# EasyEDA Pro project LED_Multichanel_bulb.eprj

# Schematic Schematic1
Board Name: Board1; Create Date: 2025-07-30; Page Name: P1; Project Name: LED_Multichanel_bulb; Schematic Name: Schematic1; Update Date: 2025-07-30; Company: embedberight.com; Page Size: A4; Version: V1.0
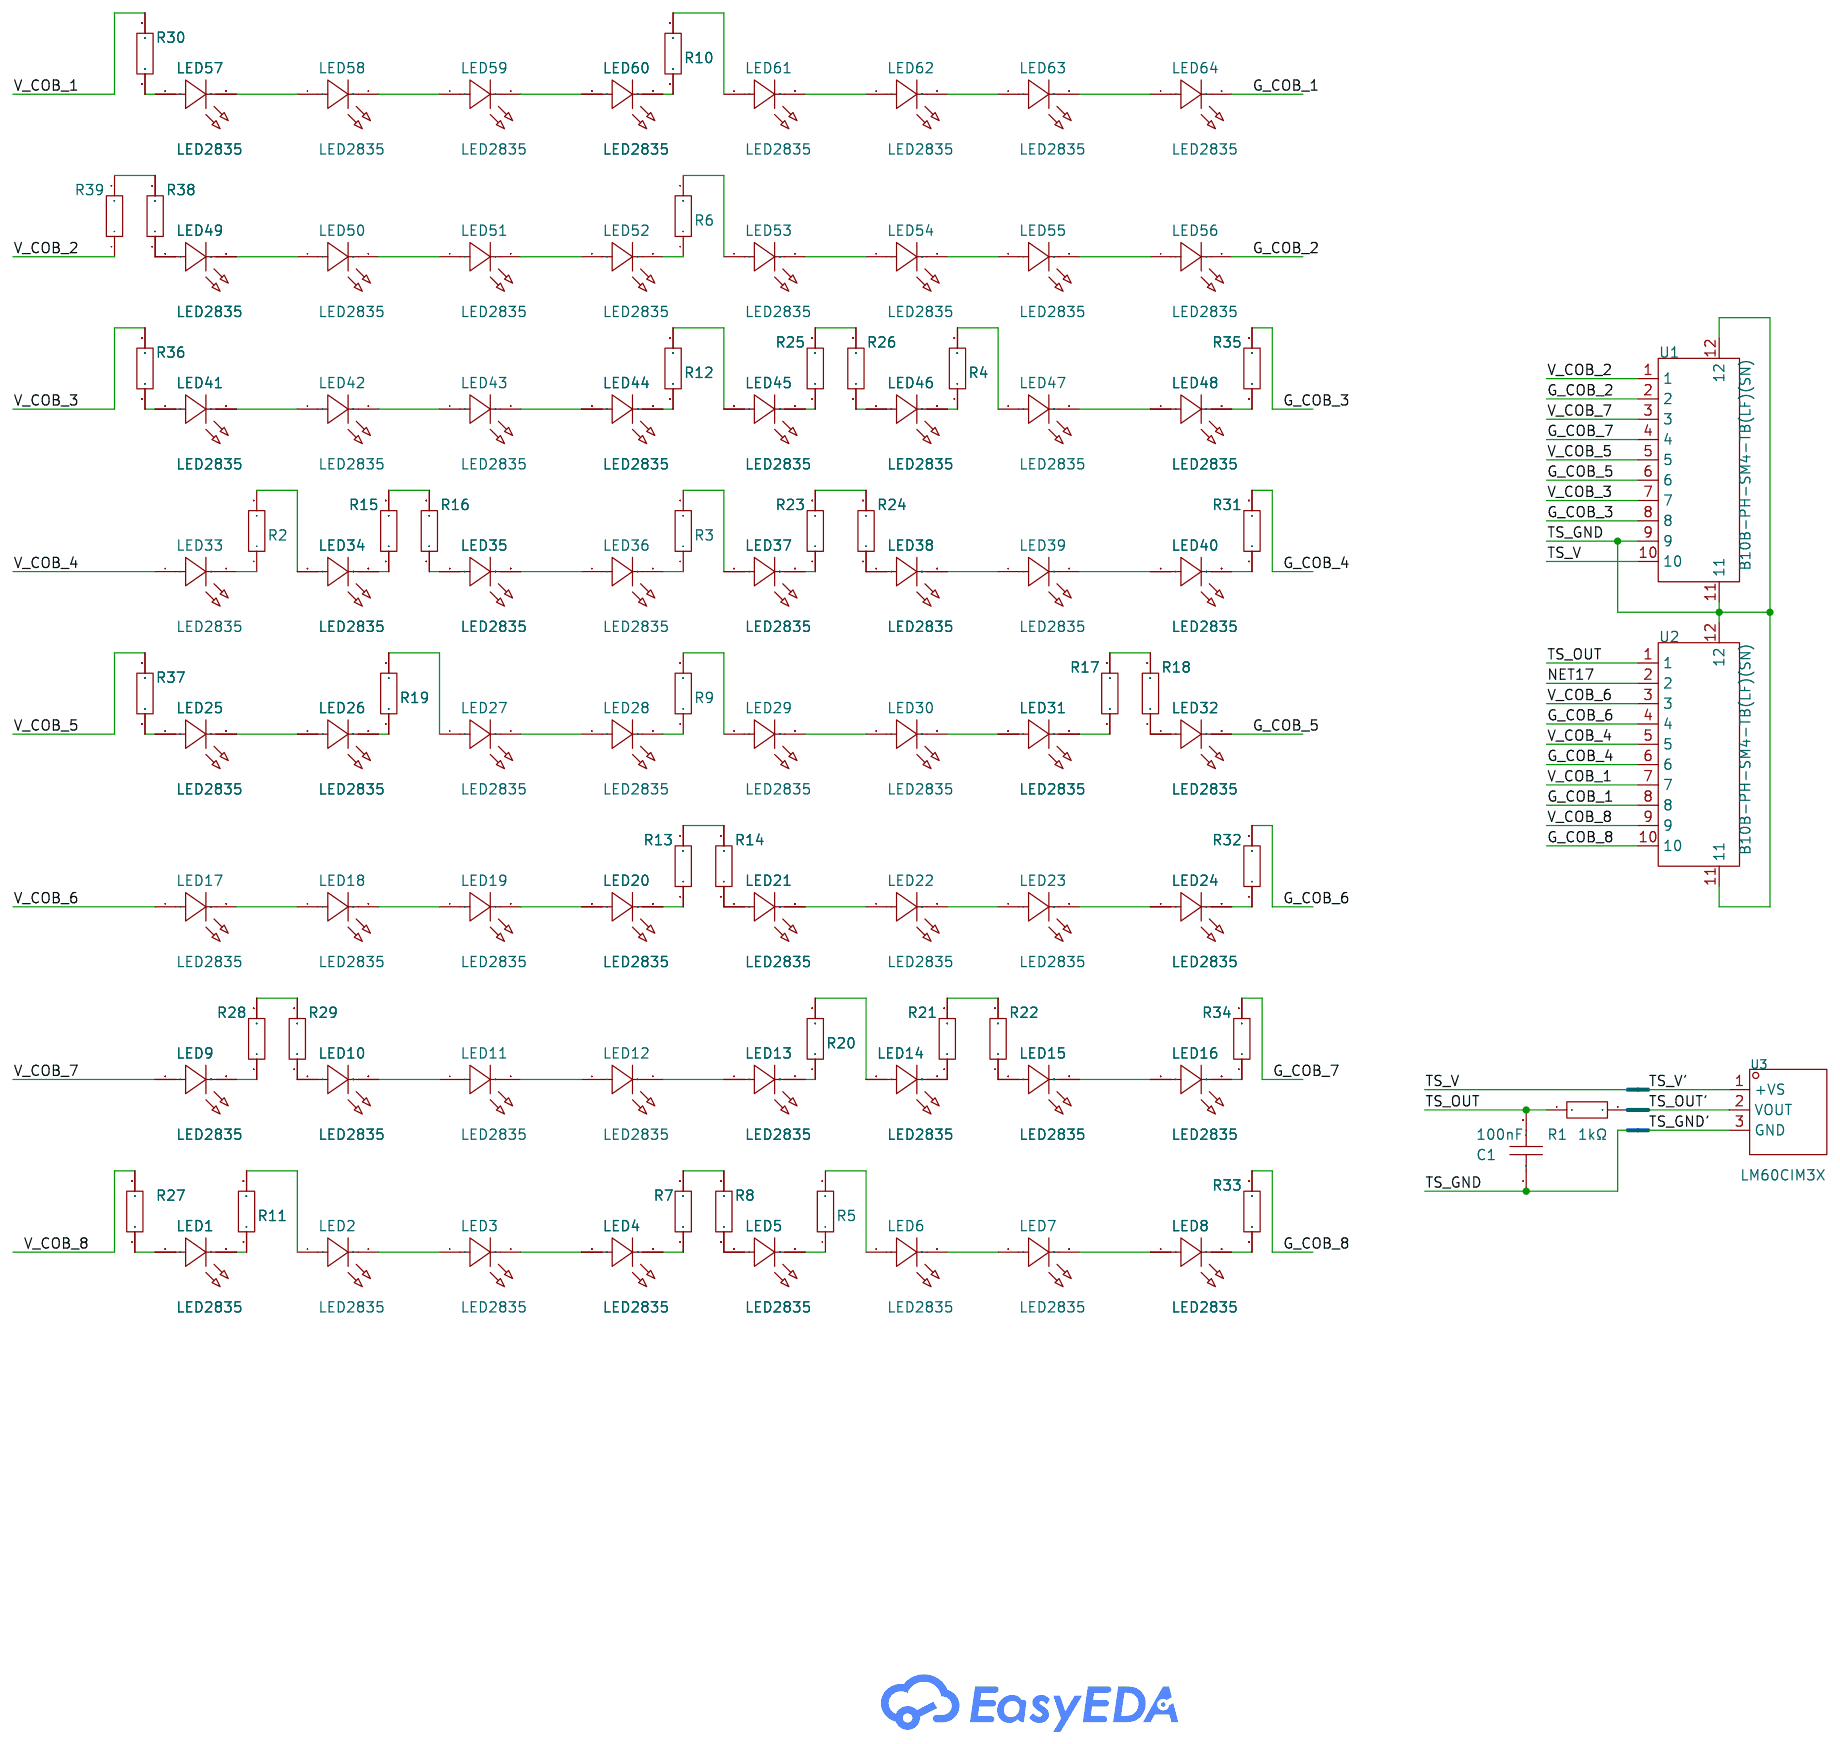
[diagram p0: schematic sheet]

## Parts
C1  100nF  [C0805]
LED1  LED2835  [LED-SMD_L3.5-W2.8_JE2835APO-N-0001A0000-N0000001]
LED2  LED2835  [LED-SMD_L3.5-W2.8_JE2835APO-N-0001A0000-N0000001]
LED3  LED2835  [LED-SMD_L3.5-W2.8_JE2835APO-N-0001A0000-N0000001]
LED4  LED2835  [LED-SMD_L3.5-W2.8_JE2835APO-N-0001A0000-N0000001]
LED5  LED2835  [LED-SMD_L3.5-W2.8_JE2835APO-N-0001A0000-N0000001]
LED6  LED2835  [LED-SMD_L3.5-W2.8_JE2835APO-N-0001A0000-N0000001]
LED7  LED2835  [LED-SMD_L3.5-W2.8_JE2835APO-N-0001A0000-N0000001]
LED8  LED2835  [LED-SMD_L3.5-W2.8_JE2835APO-N-0001A0000-N0000001]
LED9  LED2835  [LED-SMD_L3.5-W2.8_JE2835APO-N-0001A0000-N0000001]
LED10  LED2835  [LED-SMD_L3.5-W2.8_JE2835APO-N-0001A0000-N0000001]
LED11  LED2835  [LED-SMD_L3.5-W2.8_JE2835APO-N-0001A0000-N0000001]
LED12  LED2835  [LED-SMD_L3.5-W2.8_JE2835APO-N-0001A0000-N0000001]
LED13  LED2835  [LED-SMD_L3.5-W2.8_JE2835APO-N-0001A0000-N0000001]
LED14  LED2835  [LED-SMD_L3.5-W2.8_JE2835APO-N-0001A0000-N0000001]
LED15  LED2835  [LED-SMD_L3.5-W2.8_JE2835APO-N-0001A0000-N0000001]
LED16  LED2835  [LED-SMD_L3.5-W2.8_JE2835APO-N-0001A0000-N0000001]
LED17  LED2835  [LED-SMD_L3.5-W2.8_JE2835APO-N-0001A0000-N0000001]
LED18  LED2835  [LED-SMD_L3.5-W2.8_JE2835APO-N-0001A0000-N0000001]
LED19  LED2835  [LED-SMD_L3.5-W2.8_JE2835APO-N-0001A0000-N0000001]
LED20  LED2835  [LED-SMD_L3.5-W2.8_JE2835APO-N-0001A0000-N0000001]
LED21  LED2835  [LED-SMD_L3.5-W2.8_JE2835APO-N-0001A0000-N0000001]
LED22  LED2835  [LED-SMD_L3.5-W2.8_JE2835APO-N-0001A0000-N0000001]
LED23  LED2835  [LED-SMD_L3.5-W2.8_JE2835APO-N-0001A0000-N0000001]
LED24  LED2835  [LED-SMD_L3.5-W2.8_JE2835APO-N-0001A0000-N0000001]
LED25  LED2835  [LED-SMD_L3.5-W2.8_JE2835APO-N-0001A0000-N0000001]
LED26  LED2835  [LED-SMD_L3.5-W2.8_JE2835APO-N-0001A0000-N0000001]
LED27  LED2835  [LED-SMD_L3.5-W2.8_JE2835APO-N-0001A0000-N0000001]
LED28  LED2835  [LED-SMD_L3.5-W2.8_JE2835APO-N-0001A0000-N0000001]
LED29  LED2835  [LED-SMD_L3.5-W2.8_JE2835APO-N-0001A0000-N0000001]
LED30  LED2835  [LED-SMD_L3.5-W2.8_JE2835APO-N-0001A0000-N0000001]
LED31  LED2835  [LED-SMD_L3.5-W2.8_JE2835APO-N-0001A0000-N0000001]
LED32  LED2835  [LED-SMD_L3.5-W2.8_JE2835APO-N-0001A0000-N0000001]
LED33  LED2835  [LED-SMD_L3.5-W2.8_JE2835APO-N-0001A0000-N0000001]
LED34  LED2835  [LED-SMD_L3.5-W2.8_JE2835APO-N-0001A0000-N0000001]
LED35  LED2835  [LED-SMD_L3.5-W2.8_JE2835APO-N-0001A0000-N0000001]
LED36  LED2835  [LED-SMD_L3.5-W2.8_JE2835APO-N-0001A0000-N0000001]
LED37  LED2835  [LED-SMD_L3.5-W2.8_JE2835APO-N-0001A0000-N0000001]
LED38  LED2835  [LED-SMD_L3.5-W2.8_JE2835APO-N-0001A0000-N0000001]
LED39  LED2835  [LED-SMD_L3.5-W2.8_JE2835APO-N-0001A0000-N0000001]
LED40  LED2835  [LED-SMD_L3.5-W2.8_JE2835APO-N-0001A0000-N0000001]
LED41  LED2835  [LED-SMD_L3.5-W2.8_JE2835APO-N-0001A0000-N0000001]
LED42  LED2835  [LED-SMD_L3.5-W2.8_JE2835APO-N-0001A0000-N0000001]
LED43  LED2835  [LED-SMD_L3.5-W2.8_JE2835APO-N-0001A0000-N0000001]
LED44  LED2835  [LED-SMD_L3.5-W2.8_JE2835APO-N-0001A0000-N0000001]
LED45  LED2835  [LED-SMD_L3.5-W2.8_JE2835APO-N-0001A0000-N0000001]
LED46  LED2835  [LED-SMD_L3.5-W2.8_JE2835APO-N-0001A0000-N0000001]
LED47  LED2835  [LED-SMD_L3.5-W2.8_JE2835APO-N-0001A0000-N0000001]
LED48  LED2835  [LED-SMD_L3.5-W2.8_JE2835APO-N-0001A0000-N0000001]
LED49  LED2835  [LED-SMD_L3.5-W2.8_JE2835APO-N-0001A0000-N0000001]
LED50  LED2835  [LED-SMD_L3.5-W2.8_JE2835APO-N-0001A0000-N0000001]
LED51  LED2835  [LED-SMD_L3.5-W2.8_JE2835APO-N-0001A0000-N0000001]
LED52  LED2835  [LED-SMD_L3.5-W2.8_JE2835APO-N-0001A0000-N0000001]
LED53  LED2835  [LED-SMD_L3.5-W2.8_JE2835APO-N-0001A0000-N0000001]
LED54  LED2835  [LED-SMD_L3.5-W2.8_JE2835APO-N-0001A0000-N0000001]
LED55  LED2835  [LED-SMD_L3.5-W2.8_JE2835APO-N-0001A0000-N0000001]
LED56  LED2835  [LED-SMD_L3.5-W2.8_JE2835APO-N-0001A0000-N0000001]
LED57  LED2835  [LED-SMD_L3.5-W2.8_JE2835APO-N-0001A0000-N0000001]
LED58  LED2835  [LED-SMD_L3.5-W2.8_JE2835APO-N-0001A0000-N0000001]
LED59  LED2835  [LED-SMD_L3.5-W2.8_JE2835APO-N-0001A0000-N0000001]
LED60  LED2835  [LED-SMD_L3.5-W2.8_JE2835APO-N-0001A0000-N0000001]
LED61  LED2835  [LED-SMD_L3.5-W2.8_JE2835APO-N-0001A0000-N0000001]
LED62  LED2835  [LED-SMD_L3.5-W2.8_JE2835APO-N-0001A0000-N0000001]
LED63  LED2835  [LED-SMD_L3.5-W2.8_JE2835APO-N-0001A0000-N0000001]
LED64  LED2835  [LED-SMD_L3.5-W2.8_JE2835APO-N-0001A0000-N0000001]
R1  1kΩ  [R0805]
R2  10kΩ  [R1206]
R3  10kΩ  [R1206]
R4  10kΩ  [R1206]
R5  10kΩ  [R1206]
R6  10kΩ  [R1206]
R7  10kΩ  [R1206]
R8  10kΩ  [R1206]
R9  10kΩ  [R1206]
R10  10kΩ  [R1206]
R11  10kΩ  [R1206]
R12  10kΩ  [R1206]
R13  10kΩ  [R1206]
R14  10kΩ  [R1206]
R15  10kΩ  [R1206]
R16  10kΩ  [R1206]
R17  10kΩ  [R1206]
R18  10kΩ  [R1206]
R19  10kΩ  [R1206]
R20  10kΩ  [R1206]
R21  10kΩ  [R1206]
R22  10kΩ  [R1206]
R23  10kΩ  [R1206]
R24  10kΩ  [R1206]
R25  10kΩ  [R1206]
R26  10kΩ  [R1206]
R27  10kΩ  [R1206]
R28  10kΩ  [R1206]
R29  10kΩ  [R1206]
R30  10kΩ  [R1206]
R31  10kΩ  [R1206]
R32  10kΩ  [R1206]
R33  10kΩ  [R1206]
R34  10kΩ  [R1206]
R35  10kΩ  [R1206]
R36  10kΩ  [R1206]
R37  10kΩ  [R1206]
R38  10kΩ  [R1206]
R39  10kΩ  [R1206]
U1  B10B-PH-SM4-TB(LF)(SN)  [CONN-SMD_B10B-PH-SM4-TB-LF-SN]
U2  B10B-PH-SM4-TB(LF)(SN)  [CONN-SMD_B10B-PH-SM4-TB-LF-SN]
U3  LM60CIM3X  [SOT-23-3_L2.9-W1.3-P1.90-LS2.4-BR]

## Library data of the parts
C1 = CAP_0805: Supplier Footprint: 0805
LED1-LED64 = JE2835APO-N-0001A0000-N0000001: Supplier Part: C17632178; Manufacturer: WOLFSPEED; Supplier Footprint: SMD2835; JLCPCB Part Class: Extended Part; Datasheet: https://atta.szlcsc.com/upload/public/pdf/source/20231113/C6641F8E4F7B2C21D7D11EA73F223DEE.pdf; Supplier: LCSC
R1 = ERA6AEB102V: Type:Thin Film Resistor Resistance:1kΩ Tolerance:±0.1% Tolerance:±0.1% Power(Watts): Overload Voltage (Max): Temperature Coefficient:±25ppm/℃ Temperature Coefficient:±25ppm/℃ Operating Temperature Range:-55℃~+155℃ Operating Temperature Range:-55℃~+155℃; LCSC Part Name: 薄膜电阻 1kΩ ±0.1% 125mW; Supplier Part: C192073; Manufacturer: PANASONIC(松下); Supplier Footprint: 0805; JLCPCB Part Class: Extended Part; Datasheet: https://atta.szlcsc.com/upload/public/pdf/source/20180524/C193243_69C9336F256DFDBAD8C5AF89B6F85EFB.pdf; Supplier: LCSC; Type: Thin Film Resistor; Tolerance: ±0.1%; Temperature Coefficient: ±25ppm/℃; Operating Temperature Range: -55℃~+155℃
R2-R39 = Res_1206: Supplier Footprint: 1206
U1 U2 = B10B-PH-SM4-TB(LF)(SN): Pins Structure:1x10P Pitch:2mm Mounting Style:Brick nogging Reference Series:PH Number of Pins:10P Number of Rows:1 Number of PINs Per Row:10 Row Spacing:- Current Rating (Max):2A Contact Material:Copper Alloy Contact Plating:Tin Operating Temperature Ran; LCSC Part Name: 1x10P 间距:2mm 立贴 系列:PH; Supplier Part: C264997; Manufacturer: JST; Supplier Footprint: SMD,P=2mm; JLCPCB Part Class: Extended Part; Datasheet: https://atta.szlcsc.com/upload/public/pdf/source/20181010/C265101_22107ACC4D8714694FDA2DD97145FA81.pdf; Supplier: LCSC; Pins Structure: 1x10P; Pitch: 2mm; Mounting Style: Brick nogging; Reference Series: PH; Number of Pins: 10P; Number of Rows: 1; Number of PINs Per Row: 10; Current Rating (Max): 2A; Contact Material: Copper Alloy; Contact Plating: Tin; Operating Temperature Range: -25℃~+85℃; Rated Voltage (Max): 100V; Plastic Material: PA; Flame Retardant Rating: UL94V-0; Supplementary Features: 辅助焊脚; Colour: 米色; Z-Height of the Board: 6.6mm; X-Length of Bottom Edge on Board (Spacing Line): 23.95mm; Y-Width of Bottom Edge on Board: 7mm
U3 = LM60CIM3X/NOPB: Supply Voltage:2.7V~10V Supply Voltage:2.7V~10V; Supplier Part: C94768; Manufacturer: TI(德州仪器); Supplier Footprint: SOT-23; JLCPCB Part Class: Extended Part; Datasheet: https://www.ti.com/cn/lit/gpn/lm60; Supplier: LCSC; Supply Voltage: 2.7V~10V

## Nets
G_COB_1: LED64.2(C) U2.8
G_COB_2: LED56.2(C) U1.2
G_COB_3: R35.2 U1.8
G_COB_4: R31.2 U2.6
G_COB_5: LED32.2(C) U1.6
G_COB_6: R32.2 U2.4
G_COB_7: R34.2 U1.4
G_COB_8: R33.2 U2.10
NET17: U2.2
TS_GND: C1.1 U1.9 U1.11 U1.12 U2.11 U2.12
TS_GND': U3.3(GND)
TS_OUT: C1.2 R1.1 U2.1
TS_OUT': U3.2(VOUT)
TS_V: U1.10
TS_V': U3.1(+VS)
V_COB_1: R30.2 U2.7
V_COB_2: R39.1 U1.1
V_COB_3: R36.2 U1.7
V_COB_4: LED33.1(A) U2.5
V_COB_5: R37.2 U1.5
V_COB_6: LED17.1(A) U2.3
V_COB_7: LED9.1(A) U1.3
V_COB_8: R27.2 U2.9
$1N587: LED15.2(C) LED16.1(A)
$1N593: LED11.2(C) LED12.1(A)
$1N595: LED10.2(C) LED11.1(A)
$1N599: LED12.2(C) LED13.1(A)
$1N841: LED23.2(C) LED24.1(A)
$1N845: LED22.2(C) LED23.1(A)
$1N849: LED18.2(C) LED19.1(A)
$1N851: LED17.2(C) LED18.1(A)
$1N1097: LED29.2(C) LED30.1(A)
$1N1099: LED30.2(C) LED31.1(A)
$1N1101: LED27.2(C) LED28.1(A)
$1N1105: LED25.2(C) LED26.1(A)
$1N1349: LED39.2(C) LED40.1(A)
$1N1353: LED38.2(C) LED39.1(A)
$1N1355: LED35.2(C) LED36.1(A)
$1N1603: LED47.2(C) LED48.1(A)
$1N1609: LED43.2(C) LED44.1(A)
$1N1611: LED42.2(C) LED43.1(A)
$1N1613: LED41.2(C) LED42.1(A)
$1N1857: LED55.2(C) LED56.1(A)
$1N1859: LED53.2(C) LED54.1(A)
$1N1861: LED54.2(C) LED55.1(A)
$1N1863: LED51.2(C) LED52.1(A)
$1N1865: LED50.2(C) LED51.1(A)
$1N1867: LED49.2(C) LED50.1(A)
$1N2111: LED63.2(C) LED64.1(A)
$1N2113: LED61.2(C) LED62.1(A)
$1N2115: LED62.2(C) LED63.1(A)
$1N2117: LED59.2(C) LED60.1(A)
$1N2119: LED58.2(C) LED59.1(A)
$1N2121: LED57.2(C) LED58.1(A)
$1N2397: LED7.2(C) LED8.1(A)
$1N2403: LED6.2(C) LED7.1(A)
$1N2405: LED2.2(C) LED3.1(A)
$1N2407: LED3.2(C) LED4.1(A)
$1N3236: LED33.2(C) R2.1
$1N3264: LED34.1(A) R2.2
$1N3381: LED37.1(A) R3.2
$1N3386: LED36.2(C) R3.1
$1N3484: LED46.2(C) R4.1
$1N3488: LED47.1(A) R4.2
$1N3515: LED5.2(C) R5.1
$1N3519: LED6.1(A) R5.2
$1N3548: LED53.1(A) R6.2
$1N3553: LED52.2(C) R6.1
$1N3579: R7.2 R8.2
$1N3584: LED4.2(C) R7.1
$1N3610: LED5.1(A) R8.1
$1N3636: LED28.2(C) R9.1
$1N3638: LED29.1(A) R9.2
$1N3665: LED61.1(A) R10.2
$1N3668: LED60.2(C) R10.1
$1N3694: LED2.1(A) R11.2
$1N3699: LED1.2(C) R11.1
$1N3725: LED45.1(A) R12.2
$1N3730: LED44.2(C) R12.1
$1N5311: LED21.2(C) LED22.1(A)
$1N5366: LED19.2(C) LED20.1(A)
$1N5424: R13.2 R14.2
$1N5425: LED21.1(A) R14.1
$1N5429: LED20.2(C) R13.1
$1N5487: R15.2 R16.2
$1N5490: LED34.2(C) R15.1
$1N5494: LED35.1(A) R16.1
$1N5545: R17.2 R18.2
$1N5546: LED32.1(A) R18.1
$1N5550: LED31.2(C) R17.1
$1N5576: LED27.1(A) R19.2
$1N5579: LED26.2(C) R19.1
$1N5605: LED14.1(A) R20.2
$1N5611: LED13.2(C) R20.1
$1N5637: R21.2 R22.2
$1N5648: LED14.2(C) R21.1
$1N5675: LED15.1(A) R22.1
$1N5701: R23.2 R24.2
$1N5707: LED37.2(C) R23.1
$1N7310: LED38.1(A) R24.1
$1N7360: R25.2 R26.2
$1N7361: LED45.2(C) R25.1
$1N7365: LED46.1(A) R26.1
$1N7404: LED1.1(A) R27.1
$1N7468: R28.2 R29.2
$1N7469: LED10.1(A) R29.1
$1N7473: LED9.2(C) R28.1
$1N9192: LED57.1(A) R30.1
$1N9229: LED40.2(C) R31.1
$1N9270: LED24.2(C) R32.1
$1N9301: LED8.2(C) R33.1
$1N9334: LED16.2(C) R34.1
$1N9365: LED48.2(C) R35.1
$1N9391: LED41.1(A) R36.1
$1N9422: LED25.1(A) R37.1
$1N9453: R38.2 R39.2
$1N9457: LED49.1(A) R38.1

Not connected (* = marked no-connect by the designer): R1 2

# Board PCB1
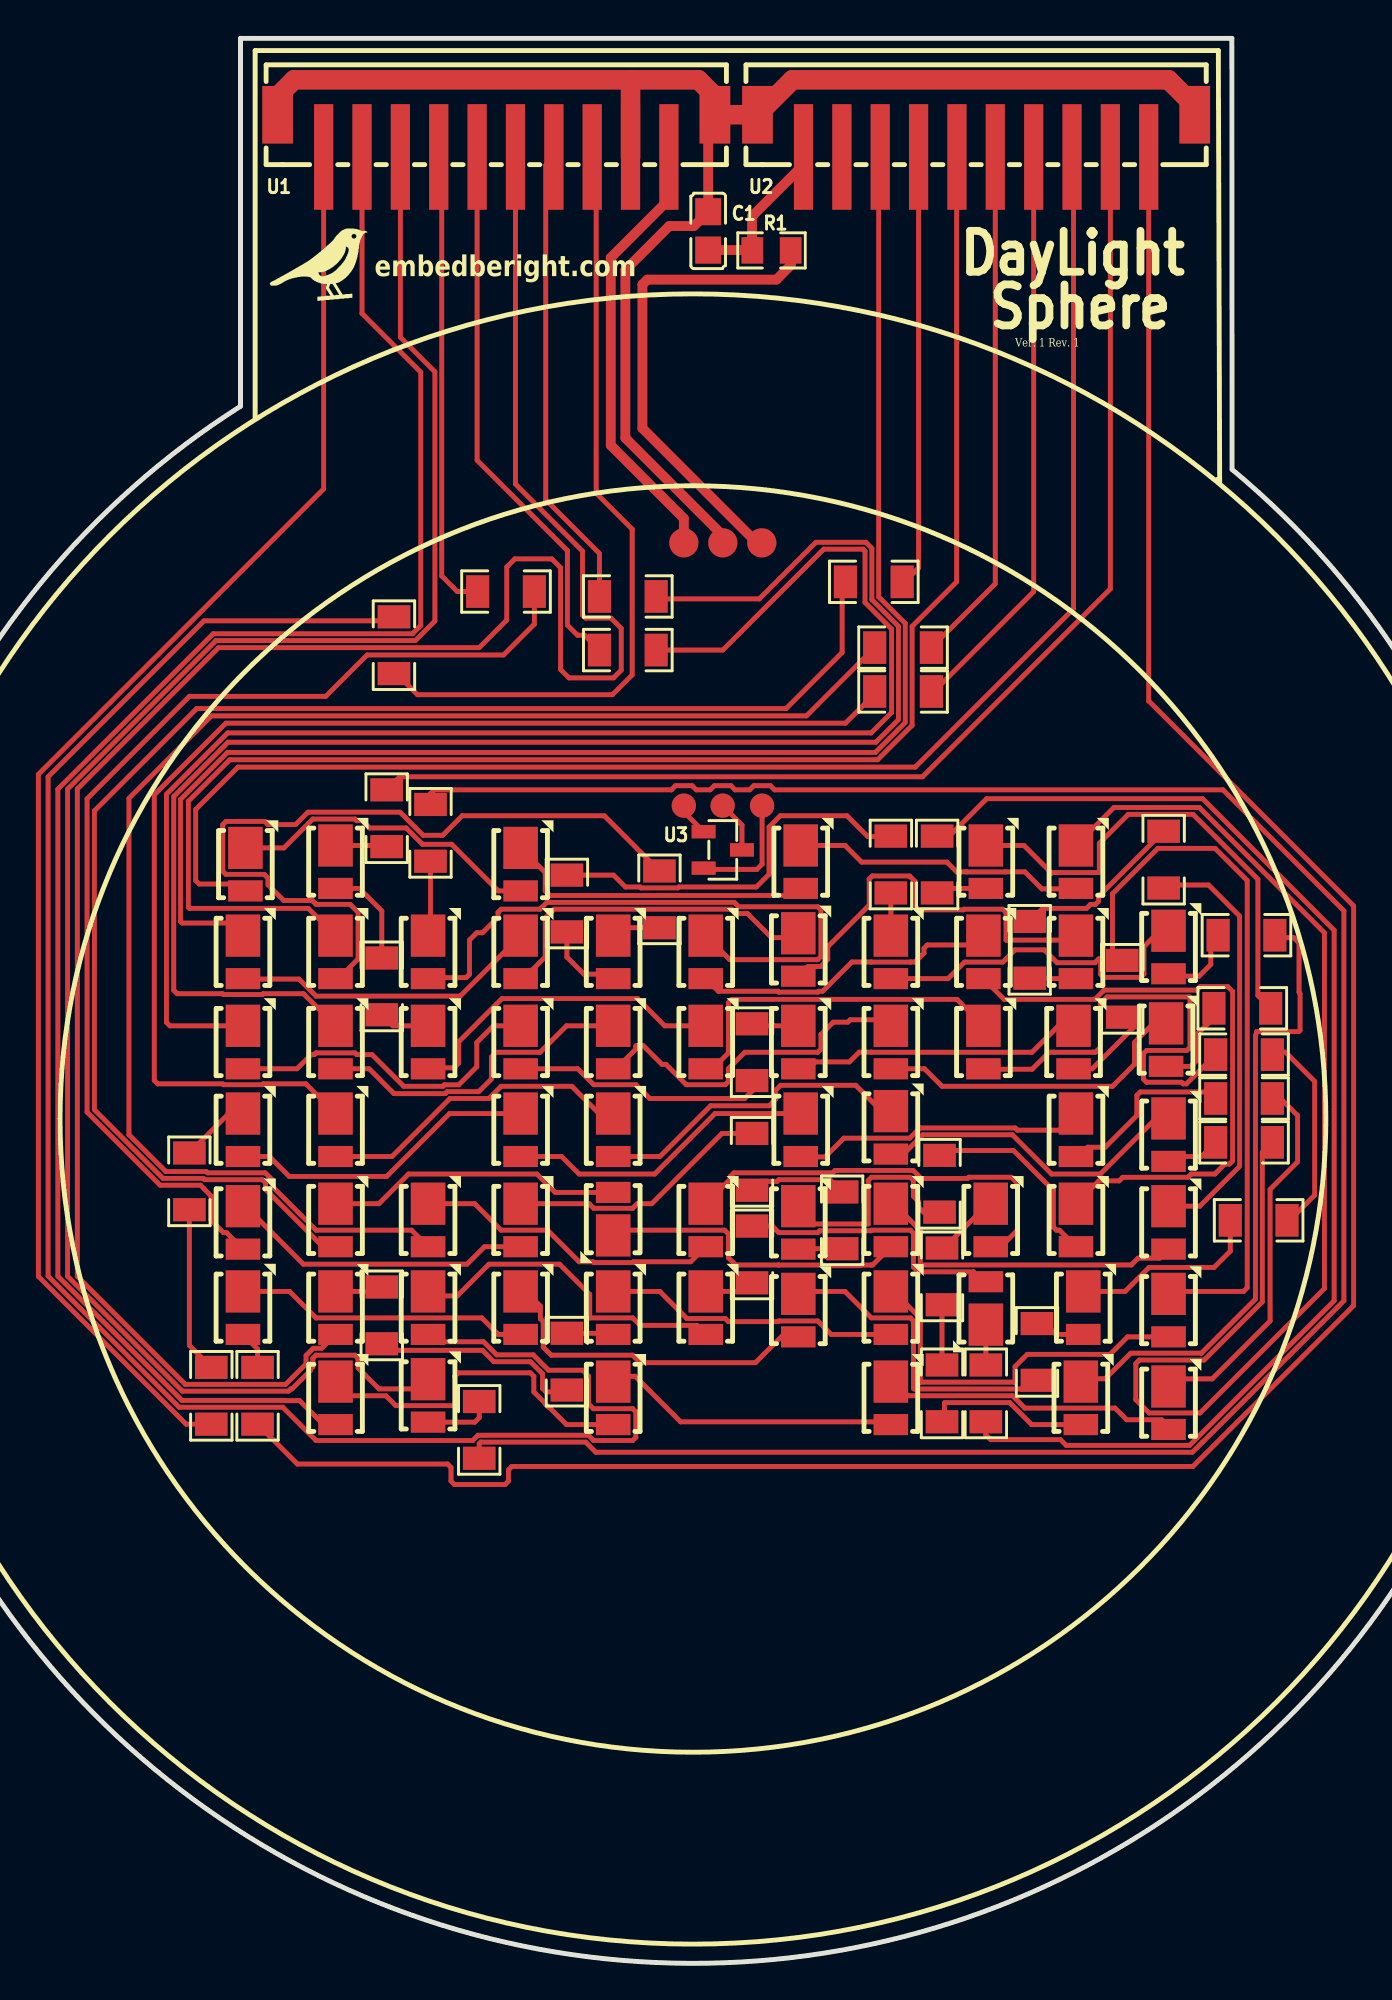
[diagram p1: board, top side]
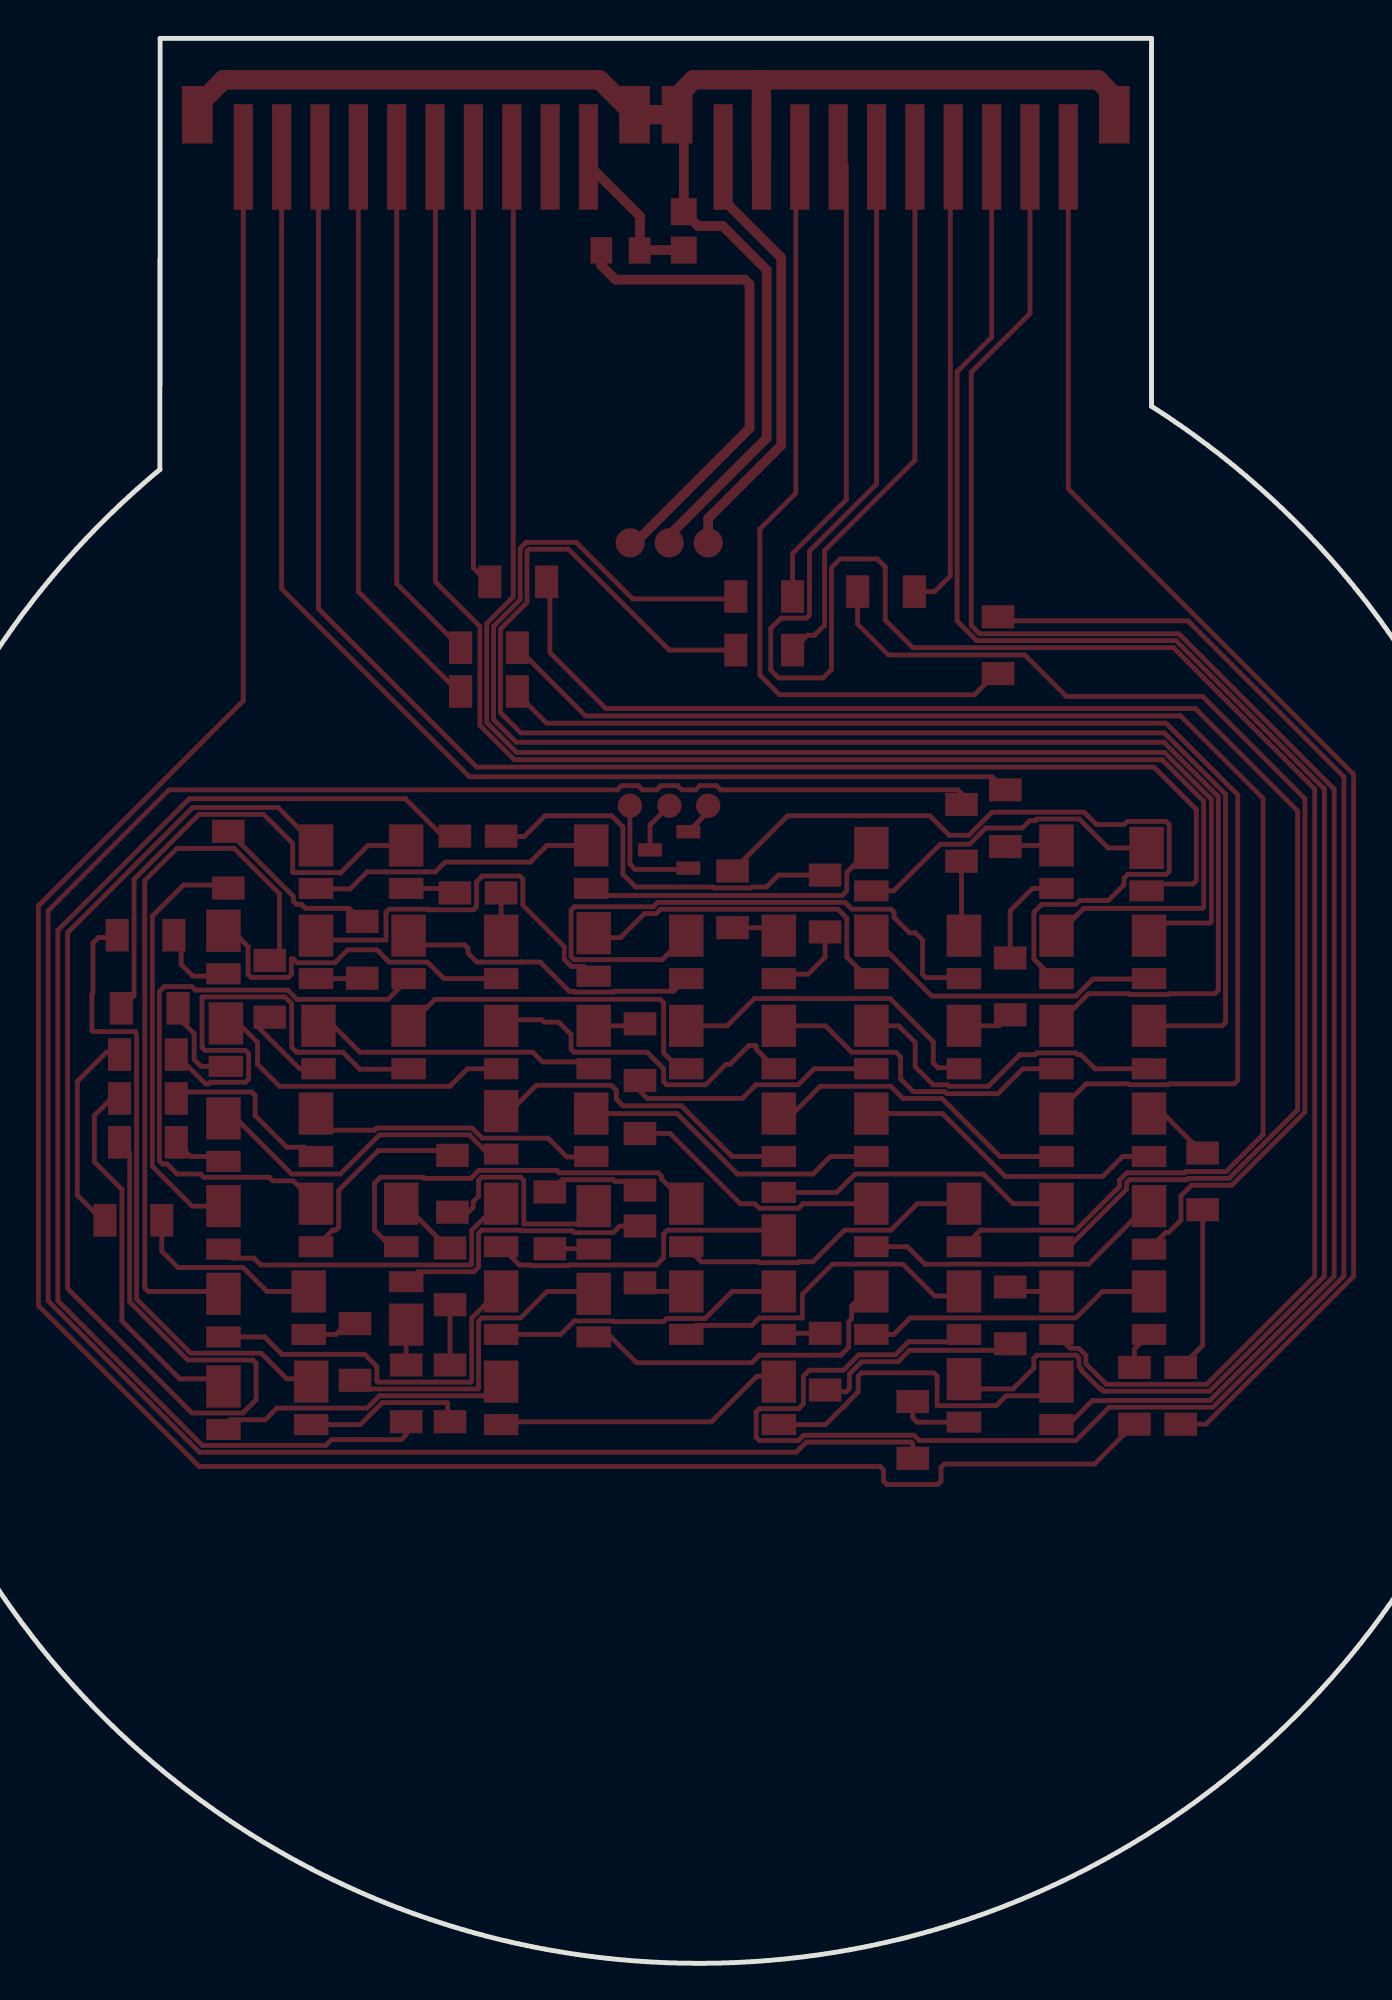
[diagram p2: board, bottom side, seen from below]

Outline 88 x 100.32 mm; copper layers: Top Layer, Bottom Layer. Coordinates in mm from the lower left corner of the outline.
Outline path: 20.41,100.32 72.1,100.32 72.11,77.85 arc(41.21,0.09) 20.41,81.14 20.41,100.32
Stack: Top Layer 0.035mm / Dielectric1 1.51mm FR4 er 4.5 / Bottom Layer 0.035mm

## Design rules (mm)
template: JLCPCB Capability(Two Layers Board)
spacing copperThickness1oz (default): track to track 0.102, other pairs 0.152 to 0.3
spacing copperThickness2oz: track to track 0.203, other pairs 0.152 to 0.3
track width copperThickness1oz (default): min 0.127, default 0.254, max 2.54
track width copperThickness2oz: min 0.203, default 0.254, max 2.54
differential pair differentialPair (default): width min 0.127, default 0.254, max 2.54; gap min 0.152, default 0.152
via viaSize (default): diameter min 0.5, default 0.61, max 10; hole min 0.3, default 0.305, max 6.3

## Placement (name value [footprint] x y rotation side)
C1  100nF  [C0805]  44.8 90.28 270 top
LED1  LED2835  [LED-SMD_L3.5-W2.8_JE2835APO-N-0001A0000-N0000001]  25.37 57.14 90 top
LED2  LED2835  [LED-SMD_L3.5-W2.8_JE2835APO-N-0001A0000-N0000001]  30.19 47.74 90 top
LED3  LED2835  [LED-SMD_L3.5-W2.8_JE2835APO-N-0001A0000-N0000001]  44.67 47.74 90 top
LED4  LED2835  [LED-SMD_L3.5-W2.8_JE2835APO-N-0001A0000-N0000001]  59.15 47.74 90 top
LED5  LED2835  [LED-SMD_L3.5-W2.8_JE2835APO-N-0001A0000-N0000001]  64.35 33.9 90 top
LED6  LED2835  [LED-SMD_L3.5-W2.8_JE2835APO-N-0001A0000-N0000001]  49.5 33.77 90 top
LED7  LED2835  [LED-SMD_L3.5-W2.8_JE2835APO-N-0001A0000-N0000001]  35.02 33.9 90 top
LED8  LED2835  [LED-SMD_L3.5-W2.8_JE2835APO-N-0001A0000-N0000001]  20.54 33.9 90 top
LED9  LED2835  [LED-SMD_L3.5-W2.8_JE2835APO-N-0001A0000-N0000001]  30.19 29.32 90 top
LED10  LED2835  [LED-SMD_L3.5-W2.8_JE2835APO-N-0001A0000-N0000001]  30.19 52.44 90 top
LED11  LED2835  [LED-SMD_L3.5-W2.8_JE2835APO-N-0001A0000-N0000001]  44.67 52.44 90 top
LED12  LED2835  [LED-SMD_L3.5-W2.8_JE2835APO-N-0001A0000-N0000001]  59.15 52.44 90 top
LED13  LED2835  [LED-SMD_L3.5-W2.8_JE2835APO-N-0001A0000-N0000001]  63.97 38.47 90 top
LED14  LED2835  [LED-SMD_L3.5-W2.8_JE2835APO-N-0001A0000-N0000001]  49.5 38.34 90 top
LED15  LED2835  [LED-SMD_L3.5-W2.8_JE2835APO-N-0001A0000-N0000001]  35.02 38.47 90 top
LED16  LED2835  [LED-SMD_L3.5-W2.8_JE2835APO-N-0001A0000-N0000001]  20.54 38.34 90 top
LED17  LED2835  [LED-SMD_L3.5-W2.8_JE2835APO-N-0001A0000-N0000001]  20.54 52.44 90 top
LED18  LED2835  [LED-SMD_L3.5-W2.8_JE2835APO-N-0001A0000-N0000001]  35.02 52.44 90 top
LED19  LED2835  [LED-SMD_L3.5-W2.8_JE2835APO-N-0001A0000-N0000001]  49.5 52.56 90 top
LED20  LED2835  [LED-SMD_L3.5-W2.8_JE2835APO-N-0001A0000-N0000001]  63.97 52.44 90 top
LED21  LED2835  [LED-SMD_L3.5-W2.8_JE2835APO-N-0001A0000-N0000001]  68.8 38.34 90 top
LED22  LED2835  [LED-SMD_L3.5-W2.8_JE2835APO-N-0001A0000-N0000001]  54.32 38.47 90 top
LED23  LED2835  [LED-SMD_L3.5-W2.8_JE2835APO-N-0001A0000-N0000001]  39.84 39.06 270 top
LED24  LED2835  [LED-SMD_L3.5-W2.8_JE2835APO-N-0001A0000-N0000001]  25.37 38.47 90 top
LED25  LED2835  [LED-SMD_L3.5-W2.8_JE2835APO-N-0001A0000-N0000001]  20.54 47.74 90 top
LED26  LED2835  [LED-SMD_L3.5-W2.8_JE2835APO-N-0001A0000-N0000001]  35.02 47.74 90 top
LED27  LED2835  [LED-SMD_L3.5-W2.8_JE2835APO-N-0001A0000-N0000001]  49.5 47.74 90 top
LED28  LED2835  [LED-SMD_L3.5-W2.8_JE2835APO-N-0001A0000-N0000001]  63.85 47.74 90 top
LED29  LED2835  [LED-SMD_L3.5-W2.8_JE2835APO-N-0001A0000-N0000001]  68.8 33.77 90 top
LED30  LED2835  [LED-SMD_L3.5-W2.8_JE2835APO-N-0001A0000-N0000001]  54.32 33.9 90 top
LED31  LED2835  [LED-SMD_L3.5-W2.8_JE2835APO-N-0001A0000-N0000001]  39.84 33.9 90 top
LED32  LED2835  [LED-SMD_L3.5-W2.8_JE2835APO-N-0001A0000-N0000001]  25.37 33.9 90 top
LED33  LED2835  [LED-SMD_L3.5-W2.8_JE2835APO-N-0001A0000-N0000001]  25.37 52.44 90 top
LED34  LED2835  [LED-SMD_L3.5-W2.8_JE2835APO-N-0001A0000-N0000001]  39.84 52.44 90 top
LED35  LED2835  [LED-SMD_L3.5-W2.8_JE2835APO-N-0001A0000-N0000001]  54.32 52.44 90 top
LED36  LED2835  [LED-SMD_L3.5-W2.8_JE2835APO-N-0001A0000-N0000001]  68.8 52.69 90 top
LED37  LED2835  [LED-SMD_L3.5-W2.8_JE2835APO-N-0001A0000-N0000001]  64.23 29.2 90 top
LED38  LED2835  [LED-SMD_L3.5-W2.8_JE2835APO-N-0001A0000-N0000001]  59.53 38.47 90 top
LED39  LED2835  [LED-SMD_L3.5-W2.8_JE2835APO-N-0001A0000-N0000001]  44.67 38.47 90 top
LED40  LED2835  [LED-SMD_L3.5-W2.8_JE2835APO-N-0001A0000-N0000001]  30.19 38.47 90 top
LED41  LED2835  [LED-SMD_L3.5-W2.8_JE2835APO-N-0001A0000-N0000001]  25.37 47.74 90 top
LED42  LED2835  [LED-SMD_L3.5-W2.8_JE2835APO-N-0001A0000-N0000001]  39.84 47.74 90 top
LED43  LED2835  [LED-SMD_L3.5-W2.8_JE2835APO-N-0001A0000-N0000001]  54.32 47.74 90 top
LED44  LED2835  [LED-SMD_L3.5-W2.8_JE2835APO-N-0001A0000-N0000001]  68.67 47.87 90 top
LED45  LED2835  [LED-SMD_L3.5-W2.8_JE2835APO-N-0001A0000-N0000001]  59.27 57.14 90 top
LED46  LED2835  [LED-SMD_L3.5-W2.8_JE2835APO-N-0001A0000-N0000001]  59.27 34.4 270 top
LED47  LED2835  [LED-SMD_L3.5-W2.8_JE2835APO-N-0001A0000-N0000001]  44.67 33.9 90 top
LED48  LED2835  [LED-SMD_L3.5-W2.8_JE2835APO-N-0001A0000-N0000001]  30.19 33.9 90 top
LED49  LED2835  [LED-SMD_L3.5-W2.8_JE2835APO-N-0001A0000-N0000001]  20.54 43.17 90 top
LED50  LED2835  [LED-SMD_L3.5-W2.8_JE2835APO-N-0001A0000-N0000001]  35.02 43.17 90 top
LED51  LED2835  [LED-SMD_L3.5-W2.8_JE2835APO-N-0001A0000-N0000001]  49.62 43.17 90 top
LED52  LED2835  [LED-SMD_L3.5-W2.8_JE2835APO-N-0001A0000-N0000001]  63.97 43.17 90 top
LED53  LED2835  [LED-SMD_L3.5-W2.8_JE2835APO-N-0001A0000-N0000001]  68.8 28.94 90 top
LED54  LED2835  [LED-SMD_L3.5-W2.8_JE2835APO-N-0001A0000-N0000001]  54.32 29.2 90 top
LED55  LED2835  [LED-SMD_L3.5-W2.8_JE2835APO-N-0001A0000-N0000001]  39.84 29.2 90 top
LED56  LED2835  [LED-SMD_L3.5-W2.8_JE2835APO-N-0001A0000-N0000001]  25.37 29.2 90 top
LED57  LED2835  [LED-SMD_L3.5-W2.8_JE2835APO-N-0001A0000-N0000001]  25.37 43.17 90 top
LED58  LED2835  [LED-SMD_L3.5-W2.8_JE2835APO-N-0001A0000-N0000001]  39.84 43.17 90 top
LED59  LED2835  [LED-SMD_L3.5-W2.8_JE2835APO-N-0001A0000-N0000001]  54.32 43.29 90 top
LED60  LED2835  [LED-SMD_L3.5-W2.8_JE2835APO-N-0001A0000-N0000001]  68.8 42.91 90 top
LED61  LED2835  [LED-SMD_L3.5-W2.8_JE2835APO-N-0001A0000-N0000001]  63.97 57.14 90 top
LED62  LED2835  [LED-SMD_L3.5-W2.8_JE2835APO-N-0001A0000-N0000001]  49.62 57.14 90 top
LED63  LED2835  [LED-SMD_L3.5-W2.8_JE2835APO-N-0001A0000-N0000001]  35.02 57.01 90 top
LED64  LED2835  [LED-SMD_L3.5-W2.8_JE2835APO-N-0001A0000-N0000001]  20.67 57.01 90 top
NOREF  -  [Pad_e516]  43.53 74.03 0 top
NOREF#2  -  [Pad_e513]  45.56 74.03 0 top
NOREF#3  -  [Pad_e530]  45.55 60.33 0 top
NOREF#4  -  [Pad_e529]  43.53 60.33 0 top
NOREF#5  -  [Pad_e531]  47.61 60.33 0 top
NOREF#6  -  [Pad_e441]  47.59 74.03 0 top
R1  1kΩ  [R0805]  48.1 89.27 0 top
R2  10kΩ  [R1206]  42.26 55.45 270 top
R3  10kΩ  [R1206]  72.86 53.58 0 top
R4  10kΩ  [R1206]  47.08 36.94 270 top
R5  10kΩ  [R1206]  61.94 31.86 270 top
R6  10kΩ  [R1206]  72.74 45.07 0 top
R7  10kΩ  [R1206]  72.74 47.36 0 top
R8  10kΩ  [R1206]  73.5 38.72 0 top
R9  10kΩ  [R1206]  66.39 50.79 90 top
R10  10kΩ  [R1206]  72.74 42.79 0 top
R11  10kΩ  [R1206]  27.78 50.91 270 top
R12  10kΩ  [R1206]  72.65 49.77 0 top
R13  10kΩ  [R1206]  61.56 52.82 90 top
R14  10kΩ  [R1206]  68.55 57.52 90 top
R15  10kΩ  [R1206]  37.43 55.23 90 top
R16  10kΩ  [R1206]  54.32 57.26 90 top
R17  10kΩ  [R1206]  37.43 31.36 270 top
R18  10kΩ  [R1206]  27.78 33.77 270 top
R19  10kΩ  [R1206]  47.08 47.48 90 top
R20  10kΩ  [R1206]  56.86 40.63 270 top
R21  10kΩ  [R1206]  51.78 38.72 90 top
R22  10kΩ  [R1206]  47.08 41.77 270 top
R23  10kΩ  [R1206]  56.99 29.7 90 top
R24  10kΩ  [R1206]  56.99 35.8 270 top
R25  10kΩ  [R1206]  56.73 57.26 90 top
R26  10kΩ  [R1206]  59.27 29.7 270 top
R27  10kΩ  [R1206]  28.03 59.68 90 top
R28  10kΩ  [R1206]  32.86 27.8 270 top
R29  10kΩ  [R1206]  30.32 58.91 90 top
R30  10kΩ  [R1206]  54.96 66.28 0 top
R31  10kΩ  [R1206]  54.96 68.57 0 top
R32  10kΩ  [R1206]  53.43 72 0 top
R33  10kΩ  [R1206]  21.3 29.58 270 top
R34  10kΩ  [R1206]  34.26 71.49 180 top
R35  10kΩ  [R1206]  28.41 68.69 270 top
R36  10kΩ  [R1206]  40.61 71.23 180 top
R37  10kΩ  [R1206]  40.61 68.44 180 top
R38  10kΩ  [R1206]  17.75 40.75 270 top
R39  10kΩ  [R1206]  18.89 29.58 90 top
U1  B10B-PH-SM4-TB(LF)(SN)  [CONN-SMD_B10B-PH-SM4-TB-LF-SN]  33.75 95.24 0 top
U2  B10B-PH-SM4-TB(LF)(SN)  [CONN-SMD_B10B-PH-SM4-TB-LF-SN]  58.77 95.24 0 top
U3  LM60CIM3X  [SOT-23-3_L2.9-W1.3-P1.90-LS2.4-BR]  45.56 58.03 180 top

## Footprints (pads in the part's own frame, mm; a bottom-side part is the same pattern mirrored in y, then rotated)
C0805
  rect 1.41x1.35 smd: 1(-1,0) 2(1,0)
CONN-SMD_B10B-PH-SM4-TB-LF-SN
  rect 1x5.5 smd: 1(-9,-1.099) 2(-7,-1.099) 3(-5,-1.099) 4(-3,-1.099) 5(-1,-1.099) 6(1,-1.099) 7(3.002,-1.101) 8(5.002,-1.101) 9(7,-1.099) 10(9,-1.099)
  rect 1.6x3 smd: 11(11.4,1.101) 12(-11.4,1.101)
LED-SMD_L3.5-W2.8_JE2835APO-N-0001A0000-N0000001
  rect 2.2x1.8 smd: 1(1.12,0)
  rect 1.1x1.8 smd: 2(-1.12,0)
Pad_e441
  round 1.524 smd: 2(0,0)
Pad_e513
  round 1.524 smd: 1(0,0)
Pad_e516
  round 1.524 smd: 1(0,0)
Pad_e529
  round 1.27 smd: 1(0,0)
Pad_e530
  round 1.27 smd: 2(0,0)
Pad_e531
  round 1.27 smd: 3(0,0)
R0805
  rect 1.133x1.377 smd: 1(-1,0) 2(1,0)
R1206
  rect 1.208x1.701 smd: 1(-1.479,0) 2(1.479,0)
SOT-23-3_L2.9-W1.3-P1.90-LS2.4-BR
  rect 1.25x0.7 smd: 1(1,-0.95) 2(1,0.95) 3(-1,0)

## Nets
As in the schematic, except:
2: NOREF#6.2 R1.2
TS_GND: C1.1 NOREF#2.1 U1.9 U1.11 U1.12 U2.11 U2.12
TS_GND': NOREF#3.2 U3.3
TS_OUT': NOREF#5.3 U3.2
TS_V: NOREF.1 U1.10
TS_V': NOREF#4.1 U3.1

## Routing (per net, layer and track width the routed paths; a pad name or vN(x,y) marks a point on that pad's centre or on a via; arc(x,y) is an arc through that point)
2: length 25.5
  Top Layer w0.508: R1.2 49.1,88.49 48.35,87.74 41.62,87.74 41.37,87.49 41.37,80 47.46,73.9 47.97,73.9
G_COB_1: length 80.2
  Top Layer w0.254: LED64.2 20.31,56.25 18.25,56.25 18.07,56.43 18.07,60.13 20.28,62.34 55.59,62.34 63.85,70.59 63.85,94.06 U2.8
G_COB_2: length 91
  Top Layer w0.254: 25.37,27.95 24.87,27.95 23.49,29.32 22.78,29.32 22.76,29.34 17.36,29.34 10.89,35.81 10.89,61.19 18.99,69.29 29.38,69.29 29.81,69.72 29.81,82.92 26.75,85.98 26.75,93.88
G_COB_3: length 41
  Top Layer w0.254: U1.8 38.96,93.93 38.96,76.62 40.83,74.74 40.83,67.14 39.8,66.11 29.64,66.11 28.54,67.21
G_COB_4: length 27
  Top Layer w0.254: 59.77,94.14 59.77,71.9 R31.2
G_COB_5: length 113.1
  Top Layer w0.254: 34.75,94.14 34.75,77.09 38.24,73.59 38.24,70.27 38.41,70.1 39.73,70.1 40.26,69.57 40.26,67.39 39.86,66.99 37.54,66.99 37.1,67.43 37.1,72.73 36.64,73.19 34.72,73.19 34.29,72.77 34.29,70 32.86,68.57 19.27,68.57 11.9,61.2 11.9,35.8 17.53,30.17 22.76,30.17 23.83,31.24 23.83,31.68 24.2,32.05 24.64,32.05 25.37,32.78
G_COB_6: length 22.6
  Top Layer w0.254: 55.77,94.14 55.77,72.72 54.91,71.87
G_COB_7: length 24.1
  Top Layer w0.254: 30.75,94.14 30.9,93.98 30.9,72.3 31.72,71.49 R34.2
G_COB_8: length 127.4
  Top Layer w0.254: 67.77,94.14 67.77,65.79 78.45,55.1 78.45,34.28 70.07,25.89 34.56,25.89 34.38,25.71 34.38,25.13 34.2,24.95 31.57,24.95 31.39,25.13 31.39,25.84 31.21,26.02 23.38,26.02 R33.2
TS_GND: length 83.4
  Top Layer w0.508: NOREF#2.1 45.56,74.41 40.48,79.49 40.48,88.25 42.76,90.54 44.05,90.54 C1.1 44.8,95.99 U1.11
  Top Layer w1.016: 40.78,98.16 40.75,98.13 40.75,94.14 ; 40.78,98.16 44.29,98.16 45.15,97.3 U1.11 U2.12 49.19,98.16 68.8,98.16 70.17,96.79 U2.11 ; 40.78,98.16 23.21,98.16 22.35,97.3 22.35,96.34
TS_GND': length 2.7
  Top Layer w0.254: NOREF#3.2 46.56,59.32 U3.3
TS_OUT: length 8.3
  Top Layer w0.508: C1.2 47.08,89.28 ; 47.08,89.28 47.08,91.05 49.77,93.73 49.77,94.14 ; 47.08,89.28 R1.1
TS_OUT': length 6.2
  Top Layer w0.254: NOREF#5.3 47.61,57.28 47.34,57.01 44.62,57.01 U3.2
TS_V: length 22.9
  Top Layer w0.508: 42.75,94.14 42.75,91.92 39.72,88.89 39.72,79.11 43.53,75.3 NOREF.1
TS_V': length 1.8
  Top Layer w0.254: NOREF#4.1 43.53,60.01 U3.1
V_COB_1: length 30.2
  Top Layer w0.254: 56.44,66.15 61.77,71.49 U2.7
V_COB_2: length 76.7
  Top Layer w0.254: 24.75,94.14 24.75,76.84 9.87,61.96 9.87,35.8 17.57,28.1 R39.1
V_COB_3: length 24.2
  Top Layer w0.254: U1.7 36.33,93.71 36.33,76.27 39.13,73.47 R36.2
V_COB_4: length 83.8
  Top Layer w0.254: 57.77,94.14 57.75,94.12 57.75,72 55.43,69.67 55.43,64.52 53.63,62.72 19.86,62.72 17.69,60.56 17.69,55.03 17.75,54.98 23.95,54.98 LED33.1
V_COB_5: length 28.6
  Top Layer w0.254: R37.2 38.35,69.21 37.98,69.21 37.46,69.74 37.46,73.62 32.75,78.33 32.75,94.14
V_COB_6: length 79.4
  Top Layer w0.254: LED17.1 19.88,54.22 17.36,54.22 17.29,54.29 17.29,60.66 19.73,63.11 53.51,63.11 55.07,64.67 55.07,69.83 53.69,71.21 53.69,94.06 53.77,94.14
V_COB_7: length 96.8
  Top Layer w0.254: 30.19,30.57 LED9.1 29.68,29.94 27.63,29.94 26.54,31.02 26.54,31.53 26.38,31.7 24.35,31.7 24.19,31.53 24.19,31.09 24.06,30.97 24.06,30.9 23.1,29.94 23.03,29.94 22.91,29.82 17.38,29.82 11.4,35.8 11.4,61.2 19.13,68.93 29.53,68.93 30.55,69.95 30.55,82.94 28.75,84.74 28.75,94.14
V_COB_8: length 64.6
  Top Layer w0.254: 65.77,94.14 65.77,71.63 55.97,61.84 28.71,61.84 R27.2
$1N587: length 16.2
  Top Layer w0.254: 20.54,39.59 23.69,36.44 32.22,36.44 33.14,37.35 35.02,37.35
$1N593: length 16.1
  Top Layer w0.254: LED12.1 58.66,53.07 56.23,53.07 56.05,52.89 56.05,52.64 55.59,52.18 55.34,52.18 55.34,52.18 53.31,52.18 53.3,52.18 52.29,52.18 50.77,50.66 50.55,50.66 50.51,50.62 48.48,50.62 48.44,50.66 45.33,50.66 LED11.2
$1N595: length 32.5
  Top Layer w0.254: LED10.2 30.24,51.37 32.17,51.37 32.35,51.55 32.35,53.33 32.73,53.71 33.03,53.71 33.84,54.51 33.84,54.77 34,54.94 36.03,54.94 36.39,55.29 46.16,55.29 46.39,55.06 50.51,55.06 50.67,54.9 50.67,52.47 50.51,52.31 45.92,52.31 LED11.1
$1N599: length 31.7
  Top Layer w0.254: LED12.2 60.23,50.24 64.96,50.24 65.45,50.72 70.27,50.72 70.45,50.9 71.89,50.9 72.14,50.65 72.14,41.82 71.98,41.66 71.73,41.66 71.21,41.13 69.99,41.13 69.81,40.96 66.41,40.96 66.23,40.78 65.16,40.78 LED13.1
$1N841: length 15.5
  Top Layer w0.254: LED23.2 36.82,40.18 35.86,41.13 29.18,41.13 27.63,39.59 LED24.1
$1N845: length 16.5
  Top Layer w0.254: LED23.1 40.12,38.21 45.65,38.21 45.85,38.01 45.85,36.78 46.23,36.39 48.48,36.39 48.48,36.39 50.78,36.39 50.82,36.36 52.75,36.36 52.78,36.39 53.3,36.39 53.31,36.39 53.37,36.39 54.32,37.35
$1N849: length 17.9
  Top Layer w0.254: LED18.2 35.17,51.32 36.3,52.45 36.3,54.47 36.77,54.94 46.01,54.94 46.24,54.71 46.84,54.71 48.1,53.45 49.26,53.45 LED19.1
$1N851: length 16.2
  Top Layer w0.254: LED18.1 31.87,50.41 24.35,50.41 23.46,51.29 20.56,51.29 LED17.2
$1N1097: length 19.8
  Top Layer w0.254: LED29.2 66.66,32.65 65.75,31.74 61.43,31.74 60.8,31.1 60.8,30.34 60.75,30.29 55.91,30.29 55.86,30.34 55.86,33.63 54.47,35.02 LED30.1
$1N1099: length 15.4
  Top Layer w0.254: LED31.1 42.27,35.02 43.69,33.6 45.68,33.6 45.85,33.44 48.44,33.44 48.48,33.48 50.51,33.48 51.21,32.78 54.32,32.78
$1N1101: length 15.4
  Top Layer w0.254: LED27.2 50.03,46.62 50.38,46.98 52.16,46.98 52.67,47.48 53.3,47.48 53.31,47.48 61.68,47.48 63.06,48.86 63.97,48.86
$1N1105: length 17.6
  Top Layer w0.254: LED25.2 23.36,46.62 24.1,47.36 24.26,47.36 24.35,47.45 26.38,47.45 26.47,47.36 27.27,47.36 28.92,45.71 30.96,45.71 31.04,45.78 31.79,45.78 32.73,46.72 32.73,47.99 33.6,48.86 LED26.1
$1N1349: length 16.1
  Top Layer w0.254: 44.67,37.35 43.88,36.56 40.9,36.56 40.86,36.52 38.83,36.52 38.78,36.56 38.07,36.56 36.42,38.21 34,38.21 32.62,39.59 LED40.1
$1N1353: length 21.7
  Top Layer w0.254: 59.4,37.35 60.06,37.35 60.93,38.21 60.93,40.65 60.61,40.97 58.39,40.97 58.33,40.91 55.9,40.91 55.48,41.32 51.42,41.32 51.29,41.2 46.14,41.2 45.95,41.01 45.95,40.87 LED39.1
$1N1355: length 18.2
  Top Layer w0.254: LED35.2 57.3,51.32 58.16,52.18 60.16,52.18 60.33,52.34 60.33,52.35 60.8,52.82 62.32,52.82 62.99,52.15 64.96,52.15 65.15,52.34 65.26,52.34 65.26,51.55 65.42,51.38 67.35,51.38 67.52,51.55 67.52,52.98 68.34,53.81 LED36.1
$1N1603: length 17.5
  Top Layer w0.254: 44.67,32.78 44.2,33.25 41.25,33.25 40.86,33.64 38.62,33.64 38.62,34.87 37.05,36.44 33.37,36.44 31.72,34.78 30.42,34.78 LED48.1
$1N1609: length 16.8
  Top Layer w0.254: 68.67,48.99 68.01,48.99 67.02,47.99 67.02,46.85 65.88,45.71 56.99,45.71 56.08,46.62 LED43.2
$1N1611: length 18.3
  Top Layer w0.254: LED42.2 40,46.62 41.02,47.64 41.02,47.8 41.05,47.83 41.41,47.83 42.39,46.85 42.59,46.85 43.65,45.79 45.68,45.79 45.85,45.95 45.85,46.62 46.71,47.48 50.51,47.48 50.67,47.64 50.67,48.4 51.32,49.05 52.08,49.05 52.21,49.17 54.01,49.17 LED43.1
$1N1613: length 17.1
  Top Layer w0.254: LED41.2 27.12,46.62 28.41,45.33 31.08,45.33 31.19,45.43 32.83,45.43 33.49,46.09 33.49,47.23 33.74,47.48 36.03,47.48 37.41,48.86 LED42.1
$1N1857: length 18.2
  Top Layer w0.254: LED55.2 37.41,28.08 36.49,28.99 36.46,28.99 36.3,29.16 36.3,29.18 35.71,29.78 35.71,30.59 35.53,30.77 31.77,30.77 31.59,30.59 31.59,29.07 31.58,29.06 28.51,29.06 27.99,29.58 26.1,29.58 LED56.1
$1N1859: length 15.6
  Top Layer w0.254: LED53.2 68.8,27.97 68.44,28.33 66.62,28.33 66.01,28.94 61.31,28.94 60.67,29.58 55.21,29.58 54.96,29.83 54.81,29.83 LED54.1
$1N1861: length 15.5
  Top Layer w0.254: 39.84,30.44 39.99,30.59 40.99,30.59 43.36,28.22 54.32,28.22
$1N1863: length 15.4
  Top Layer w0.254: LED51.2 49.65,42.02 50.89,42.02 51.87,43 55.3,43 55.84,43.54 60.81,43.54 60.92,43.42 63.11,43.42 LED52.1
$1N1865: length 16.2
  Top Layer w0.254: LED50.2 37.15,42.05 38.07,41.13 42,41.13 45.15,44.29 49.5,44.29
$1N1867: length 16.3
  Top Layer w0.254: LED49.2 21.91,42.05 22.95,41.01 28.03,41.01 31.31,44.29 LED50.1
$1N2111: length 16.5
  Top Layer w0.254: LED63.2 33.85,55.89 31.42,58.32 29.9,58.32 29.05,59.17 27.14,59.17 26.76,59.55 26.47,59.55 26.38,59.64 24.18,59.64 22.68,58.13 LED64.1
$1N2113: length 15.3
  Top Layer w0.254: LED61.2 63.95,55.99 62.2,55.99 61.31,56.88 60.3,56.88 60.29,56.88 58.26,56.88 58.25,56.88 57.75,56.88 57.24,57.39 52.8,57.39 51.93,58.26 LED62.1
$1N2115: length 16.3
  Top Layer w0.254: LED62.2 49.25,55.65 36.54,55.65 36.3,55.89 36.3,56.85 LED63.1
$1N2117: length 16.9
  Top Layer w0.254: LED59.2 54.98,42.17 55.99,43.18 60.66,43.18 62.7,41.13 65.24,41.13 68.14,44.03 LED60.1
$1N2119: length 16.9
  Top Layer w0.254: 54.32,44.29 53.96,44.29 52.49,45.76 48.57,45.76 48.32,45.5 48.32,45.04 47.97,44.69 44.92,44.69 42.28,42.05 LED58.2
$1N2121: length 16.6
  Top Layer w0.254: LED58.1 39.1,44.29 37.68,45.71 34,45.71 33.37,45.07 31.33,45.07 28.31,42.05 LED57.2
$1N2397: length 15.4
  Top Layer w0.254: 35.02,32.78 33.85,32.78 32.99,33.64 24.35,33.64 22.97,35.02 LED8.1
$1N2403: length 17.8
  Top Layer w0.254: LED7.1 35.53,34.51 35.79,34.51 36.05,34.25 36.05,33.59 36.2,33.44 36.2,32.11 36.61,31.7 40.86,31.7 41.25,31.3 47.26,31.3 48.73,32.78 49.5,32.78
$1N2405: length 17.2
  Top Layer w0.254: LED2.2 30.24,46.67 31.54,46.67 31.79,46.92 31.79,48.03 34.04,50.28 41.11,50.28 42.53,48.86 LED3.1
$1N2407: length 18.1
  Top Layer w0.254: LED3.2 44.98,46.92 45.33,46.92 45.85,47.44 45.85,50.06 46.03,50.24 57.77,50.24 LED4.1
$1N3236: length 39.9
  Top Layer w0.254: LED33.2 25.52,51.32 26.54,52.34 26.54,54.77 26.13,55.19 24.35,55.19 24.15,55.39 22.66,55.39 21.85,56.21 21.85,56.55 21.65,56.75 19.65,56.75 19.49,56.91 19.49,59.34 19.65,59.51 21.68,59.51 21.85,59.34 23.28,59.34 23.93,59.99 28.73,59.99 29.93,58.79 30.95,58.79 31.97,59.8 39.38,59.8 R2.1
$1N3264: length 2.6
  Top Layer w0.254: R2.2 40.26,53.97 LED34.1
$1N3381: length 33.7
  Top Layer w0.254: 63.97,30.44 64,30.47 65.5,30.47 66.83,31.8 70.51,31.8 73.33,34.62 73.33,48.33 73.4,48.55 75.59,48.55 75.66,48.63 75.66,50.53 75.6,50.61 75.6,53.18 75.33,53.45 73.96,53.45
$1N3386: length 3.9
  Top Layer w0.254: 71,53.45 71,52.06 70.39,51.44 68.8,51.44
$1N3484: length 14.4
  Top Layer w0.254: R4.1 48.14,38.42 48.48,38.08 50.51,38.08 50.61,38.18 53.29,38.18 53.32,38.21 55.34,38.21 55.5,38.05 55.5,36.29 55.75,36.04 58.63,36.04 59.15,35.52
$1N3488: length 2.4
  Top Layer w0.254: LED47.1 47.08,35.02
$1N3515: length 2.6
  Top Layer w0.254: 63.97,32.78 62.93,32.78 62.37,33.34 61.56,33.34
$1N3519: length 16.4
  Top Layer w0.254: 61.56,30.38 61.11,29.93 55.53,29.93 55.5,29.96 55.5,33.48 55.34,33.64 53.31,33.64 51.93,35.02 49.5,35.02
$1N3548: length 19.5
  Top Layer w0.254: 68.8,30.46 71.08,30.46 74.09,33.48 74.09,40.33 75.53,41.77 75.53,44.18 74.64,45.07 R6.2
$1N3553: length 9.4
  Top Layer w0.254: LED52.2 64.1,42.05 64.59,42.53 65.5,42.53 67.15,44.18 67.15,45.23 67.33,45.41 70.79,45.41 71.13,45.07 R6.1
$1N3579: length 10.8
  Top Layer w0.254: 74.22,47.48 74.9,47.48 76.42,45.96 76.42,40.04 74.98,38.59
$1N3584: length 24.7
  Top Layer w0.254: R7.1 69.73,45.83 69.56,45.83 69.48,45.92 67.66,45.92 67.49,46.08 67.49,47.41 67.66,47.57 69.75,47.57 69.92,47.74 69.92,50.34 69.9,50.36 65.59,50.36 65.24,50.01 65.24,47.74 64.99,47.48 64.87,47.48 64.86,47.48 62.83,47.48 62.83,47.48 62.58,47.48 61.69,46.6 59.17,46.6 LED4.2
$1N3610: length 10.1
  Top Layer w0.254: 72.02,38.72 72.02,37.12 71.17,36.27 67.78,36.27 66.53,35.02 LED5.1
$1N3636: length 4.1
  Top Layer w0.254: 63.97,46.62 64.82,46.62 66.99,48.78 66.89,48.88
$1N3638: length 37.8
  Top Layer w0.254: 68.8,35.02 72.71,35.02 72.9,35.2 72.9,56.43 71.23,58.11 68.25,58.11 65.88,55.74 65.88,52.77 R9.2
$1N3665: length 66.2
  Top Layer w0.254: R10.2 73.69,42.26 73.69,34.47 70.66,31.44 67.28,31.44 67.1,31.26 67.1,29.37 67.78,28.68 70.45,28.68 76.93,35.17 76.93,53.71 70.4,60.23 65.95,60.23 LED61.1
$1N3668: length 2.8
  Top Layer w0.254: R10.1 70.52,42.05 68.8,42.05
$1N3694: length 2.7
  Top Layer w0.254: LED2.1 28.35,48.86 R11.2
$1N3699: length 5.4
  Top Layer w0.254: LED1.2 26.61,56.02 27.78,54.85 R11.1
$1N3725: length 25.3
  Top Layer w0.254: R12.2 73.46,50.44 73.46,56.49 70.08,59.88 66.7,59.88 65.19,58.37 65.19,56.88 65.15,56.85 62.73,56.85 62.7,56.82 61.26,58.26 LED45.1
$1N5311: length 17.2
  Top Layer w0.254: LED21.2 68.33,36.75 67.21,36.75 66.86,36.39 55.9,36.39 55.86,36.44 55.86,38.2 54.47,39.59 LED22.1
$1N5366: length 20.9
  Top Layer w0.254: LED19.2 50,51.95 50.66,51.95 51.03,52.32 51.03,52.98 53.19,55.14 53.19,56.5 53.36,56.67 55.29,56.67 55.33,56.63 55.34,56.63 55.61,56.36 55.61,55.07 55.77,54.9 58.1,54.9 58.13,54.94 60.16,54.94 60.33,54.77 60.33,53.33 63.74,53.33 LED20.1
$1N5424: length 9.1
  Top Layer w0.254: R13.2 62.24,54.98 64.53,54.98 64.74,55.19 64.99,55.19 65.15,55.35 65.15,55.6 R14.2
$1N5425: length 22.3
  Top Layer w0.254: LED21.1 70.43,39.46 72.51,41.54 72.51,54.58 70.89,56.2 68.7,56.2 R14.1
$1N5429: length 2.4
  Top Layer w0.254: R13.1 61.58,51.32 LED20.2
$1N5487: length 20.6
  Top Layer w0.254: R15.2 39.86,56.71 40.48,56.1 41.24,56.1 41.29,56.04 43.22,56.04 43.27,56.1 47.31,56.1 47.97,56.76 47.97,59.22 48.55,59.8 52.04,59.8 53.11,58.72 54.3,58.72 R16.2
$1N5490: length 4.2
  Top Layer w0.254: LED34.2 39.61,51.55 38.32,51.55 37.43,52.44 R15.1
$1N5494: length 2.2
  Top Layer w0.254: R16.1 LED35.1
$1N5545: length 11.2
  Top Layer w0.254: R17.2 37.33,29.78 36.34,29.78 36.16,29.96 36.16,30.72 35.53,31.36 33.62,31.36 33.03,31.95 28.12,31.95 R18.2
$1N5546: length 2.5
  Top Layer w0.254: R18.1 27.55,35.02 LED32.1
$1N5550: length 2.4
  Top Layer w0.254: 39.84,32.78 39.78,32.83 R17.1
$1N5576: length 2.5
  Top Layer w0.254: LED27.1 47.19,48.86 R19.2
$1N5579: length 13.4
  Top Layer w0.254: LED26.2 38,46.62 38.83,45.79 41.03,45.79 41.75,45.07 46.7,45.07 47.08,45.45 R19.1
$1N5605: length 11.9
  Top Layer w0.254: R20.2 56.03,39.15 55.78,39.4 55.78,39.7 55.5,39.97 55.5,40.8 55.34,40.97 53.31,40.97 53.14,40.8 53.14,38.53 50,38.53 49.5,39.03 49.5,39.59
$1N5611: length 10.3
  Top Layer w0.254: 56.86,42.36 60.72,42.36 62.79,40.28 62.79,38.37 62.96,38.21 63.11,38.21 63.97,37.35
$1N5637: length 5.2
  Top Layer w0.254: R22.2 47.55,40.75 48.39,40.75 48.48,40.84 51.14,40.84 R21.2
$1N5648: length 2.3
  Top Layer w0.254: 49.5,37.35 49.6,37.24 R21.1
$1N5675: length 13.8
  Top Layer w0.254: R22.1 45.51,43.25 41.85,39.59 41.1,39.59 40.86,39.35 38.83,39.35 38.59,39.59 LED15.1
$1N5701: length 3.2
  Top Layer w0.254: 57.12,31.18 56.99,31.31 R24.2
$1N5707: length 8.6
  Top Layer w0.254: LED37.2 61.66,28.08 60.52,29.22 57.14,29.22 57.12,29.2 57.12,28.23
$1N7310: length 2.9
  Top Layer w0.254: 59.4,39.59 57.39,37.58 57.37,37.58
$1N7360: length 65.8
  Top Layer w0.254: R26.2 59.27,27.55 59.53,27.29 63.17,27.29 63.47,26.99 69.9,26.99 77.44,34.53 77.44,53.83 70.58,60.69 59.32,60.69 57.37,58.74 R25.2
$1N7361: length 2.6
  Top Layer w0.254: R25.1 56.97,56.02 LED45.2
$1N7365: length 2.1
  Top Layer w0.254: R26.1 LED46.1
$1N7404: length 2.7
  Top Layer w0.254: R27.1 27.97,58.26 LED1.1
$1N7468: length 121.1
  Top Layer w0.254: R29.2 30.32,60.96 30.52,61.16 42.88,61.16 43.1,61.37 43.96,61.37 44.18,61.16 44.9,61.16 45.12,61.37 45.98,61.37 46.2,61.16 46.96,61.16 47.18,61.37 48.04,61.37 48.26,61.16 71.64,61.16 77.94,54.85 77.94,34.53 70.58,27.16 70.57,27.16 70.05,26.64 38.93,26.64 38.41,27.16 32.94,27.16 32.86,27.08 R28.2
$1N7469: length 3.9
  Top Layer w0.254: R29.1 30.32,53.68 LED10.1
$1N7473: length 3.6
  Top Layer w0.254: LED9.2 32.63,28.2 32.86,28.43 R28.1
$1N9192: length 64.8
  Top Layer w0.254: 53.48,66.15 51.95,64.63 19.65,64.63 15.91,60.89 15.91,46.01 16.09,45.83 19.48,45.83 19.52,45.79 21.55,45.79 21.6,45.83 23.82,45.83 LED57.1
$1N9229: length 77.9
  Top Layer w0.254: 30.19,37.35 29.33,38.21 24.35,38.21 22.07,40.48 22.07,40.82 21.7,41.2 18.69,41.2 18.62,41.26 16.52,41.26 14.6,43.18 14.6,60.71 18.89,65.01 49.92,65.01 R31.1
$1N9270: length 77.3
  Top Layer w0.254: 25.37,37.35 24.71,37.35 21.72,40.34 21.72,40.68 21.55,40.84 18.54,40.84 18.48,40.91 16.37,40.91 12.79,44.48 12.79,60.06 18.13,65.39 48.86,65.39 51.78,68.31 51.78,71.7 51.95,71.87
$1N9301: length 2
  Top Layer w0.254: 20.54,32.78 21.3,32.01 R33.1
$1N9334: length 57
  Top Layer w0.254: R34.1 35.73,69.79 34.13,68.19 27.02,68.19 24.86,66.03 17.75,66.03 12.41,60.69 12.41,44.36 16.22,40.55 18.33,40.55 18.51,40.37 18.51,40.36 18.88,39.99 18.88,38.73 19.52,38.08 19.68,38.08 LED16.2
$1N9365: length 96.8
  Top Layer w0.254: 30.19,32.78 30.57,32.39 33.08,32.39 33.77,31.71 35.67,31.71 36.47,30.91 38.25,30.91 38.43,30.73 38.43,30.72 38.56,30.6 38.56,29.16 38.81,28.91 40.86,28.91 41.02,28.74 41.02,27.41 40.86,27.25 38.83,27.25 38.55,27.52 32.79,27.52 32.52,27.25 24.35,27.25 22.62,28.98 17.21,28.98 10.38,35.81 10.38,61.84 18.51,69.96 27.81,69.96 28.41,70.56
$1N9391: length 80.9
  Top Layer w0.254: LED41.1 23.69,50.53 21.6,50.53 21.55,50.49 19.52,50.49 19.48,50.53 17.11,50.53 16.93,50.71 16.93,60.81 19.76,63.64 53.54,63.64 54.72,64.81 54.72,69.68 53.33,71.07 53.33,73.74 53.02,74.05 50.41,74.05 47.46,71.11 42.21,71.11 R36.1
$1N9422: length 77.6
  Top Layer w0.254: R37.1 45.56,68.44 50.82,73.7 52.87,73.7 52.97,73.6 52.97,70.92 54.36,69.53 54.36,65.19 53.29,64.12 19.74,64.12 16.55,60.93 16.55,49.04 16.73,48.86 LED25.1
$1N9453: length 8.7
  Top Layer w0.254: R39.2 17.75,32.2 R38.2
$1N9457: length 3.6
  Top Layer w0.254: LED49.1 19.8,44.29 R38.1
$1N3730: length 4.3
  Top Layer w0.254: 69.05,46.74 69.96,46.74 70.32,47.1 70.32,48.46 71.42,49.52

## Text on the board
Top Silkscreen Layer: DayLight | Sphere | embedberight.com | Ver. 1 Rev. 1
